# EAGLE design MinimalDuino (EAGLE 7.7.0)
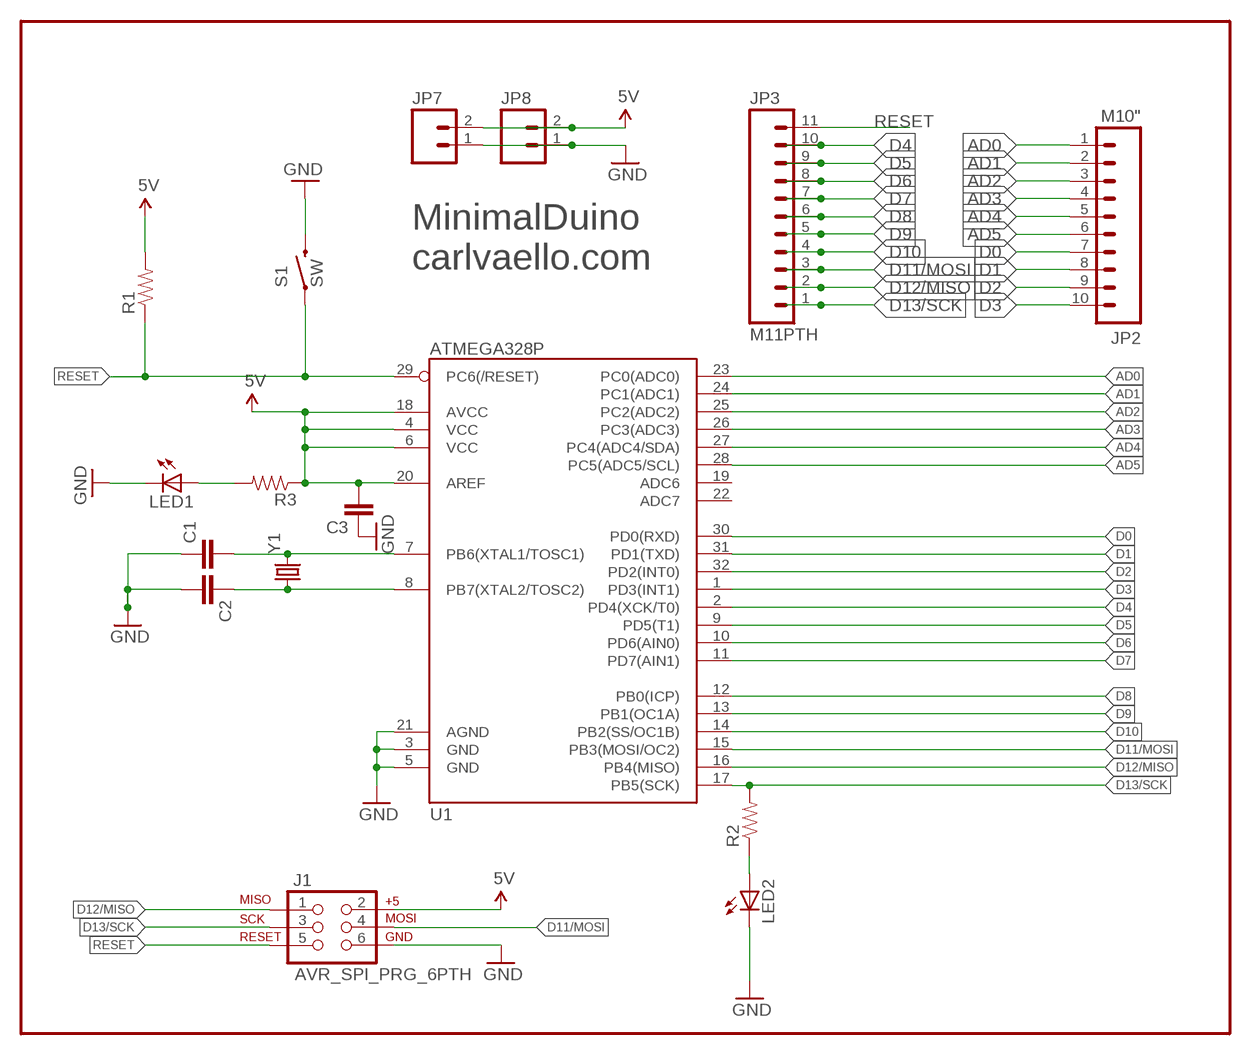
[diagram p0: schematic, sheet 1]

## Parts
C1  CAP0805  [0805]
C2  CAP0805  [0805]
C3  CAP0805  [0805]
J1  AVR_SPI_PRG_6PTH  [2X3]
JP2  M10"  [1X10]
JP3  M11PTH  [1X11]
JP7  M02PTH  [1X02]
JP8  M02PTH  [1X02]
LED1  LEDSML0805  [SML0805]
LED2  LEDSML0805  [SML0805]
R1  RESISTOR0805-RES  [0805]
R2  RESISTOR0805-RES  [0805]
R3  RESISTOR0805-RES  [0805]
S1  SW  SWITCH-MOMENTARY-2SIDE_EZ  [TACTILE-PTH-SIDEEZ]
U1  ATMEGA328P  ATMEGA328_SMT  [TQFP32-08]
Y1  CRYSTALHC49US  [HC49US]

## Nets
5V: C3.2 J1.2 JP7.2 JP8.2 R1.2 R3.1 U1.4(VCC) U1.6(VCC) U1.18(AVCC) U1.20(AREF)
AD0: JP2.1 U1.23(PC0(ADC0))
AD1: JP2.2 U1.24(PC1(ADC1))
AD2: JP2.3 U1.25(PC2(ADC2))
AD3: JP2.4 U1.26(PC3(ADC3))
AD4: JP2.5 U1.27(PC4(ADC4/SDA))
AD5: JP2.6 U1.28(PC5(ADC5/SCL))
D0: JP2.7 U1.30(PD0(RXD))
D1: JP2.8 U1.31(PD1(TXD))
D2: JP2.9 U1.32(PD2(INT0))
D3: JP2.10 U1.1(PD3(INT1))
D4: JP3.10 U1.2(PD4(XCK/T0))
D5: JP3.9 U1.9(PD5(T1))
D6: JP3.8 U1.10(PD6(AIN0))
D7: JP3.7 U1.11(PD7(AIN1))
D8: JP3.6 U1.12(PB0(ICP))
D9: JP3.5 U1.13(PB1(OC1A))
D10: JP3.4 U1.14(PB2(SS/OC1B))
D11/MOSI: J1.4 JP3.3 U1.15(PB3(MOSI/OC2))
D12/MISO: J1.1 JP3.2 U1.16(PB4(MISO))
D13/SCK: J1.3 JP3.1 R2.2 U1.17(PB5(SCK))
GND: C1.1 C2.2 C3.1 J1.6 JP7.1 JP8.1 LED1.C LED2.C S1.2 U1.3(GND) U1.5(GND) U1.21(AGND)
N$1: C1.2 U1.7(PB6(XTAL1/TOSC1)) Y1.2
N$2: C2.1 U1.8(PB7(XTAL2/TOSC2)) Y1.1
N$3: LED1.A R3.2
N$4: LED2.A R2.1
RESET: J1.5 JP3.11 R1.1 S1.1 U1.29(PC6(/RESET))
Unconnected: U1.19(ADC6) U1.22(ADC7)

## Notes on the sheet
- MinimalDuino
  carlvaello.com

## Library data of the parts
C1-C3 = SparkFun-Passives:CAP: Capacitor Standard 0603 ceramic capacitor, and 0.1" leaded capacitor.
J1 = SparkFun-Connectors:AVR_SPI_PRG_6: AVR ISP 6 Pin This is the reduced ISP connector for AVR programming. Common on Arduino. This footprint will take up less PCB space and can be used with a 10-pin to 6-pin adapter such as SKU: BOB-08508
JP2 = SparkFun-Connectors:M10: Header 10 Standard 10-pin 0.1" header. Use with straight break away headers (SKU : PRT-00116), right angle break away headers (PRT-00553), swiss pins (PRT-00743), machine pins (PRT-00117), and female headers (PRT-00115).
JP3 = SparkFun-Connectors:M11: Header 11 Standard 11-pin 0.1" header. Use with straight break away headers (SKU : PRT-00116), right angle break away headers (PRT-00553), swiss pins (PRT-00743), machine pins (PRT-00117), and female headers (PRT-00115).
JP7 JP8 = SparkFun-Connectors:M02: Header 2 Standard 2-pin 0.1" header. Use with straight break away headers (SKU : PRT-00116), right angle break away headers (PRT-00553), swiss pins (PRT-00743), machine pins (PRT-00117), and female headers (PRT-00115). Molex polarized connector foot print use with SKU : PRT-08233 with associated crimp pins and housings.
LED1 LED2 = led:LED: LED OSRAM: - CHIPLED LG R971, LG N971, LY N971, LG Q971, LY Q971, LO R971, LY R971 LH N974, LH R974 LS Q976, LO Q976, LY Q976 LO Q996 - Hyper CHIPLED LW Q18S LB Q993, LB Q99A, LB R99A - SideLED LS A670, LO A670, LY A670, LG A670, LP A670 LB A673, LV A673, LT A673, LW A673 LH A674 LY A675 LS A676, LA A676, LO A676, LY A676, LW A676 LS A679, LY A679, LG A679 - Hyper Micro SIDELED® LS Y876, LA Y876, LO Y876, LY Y876 LT Y87S - SmartLED LW L88C, LW L88S LB L89C, LB L89S, LG L890 LS L89K, LO L89K, LY L89K LS L896, LA L896, LO L896, LY L896 - TOPLED LS T670, LO T670, LY T670, LG T670, LP T670 LSG T670, LSP T670, LSY T670, LOP T670, LYG T670 LG T671, LOG T671, LSG T671 LB T673, LV T673, LT T673, LW T673 LH T674 LS T676, LA T676, LO T676, LY T676, LB T676, LH T676, LSB T676, LW T676 LB T67C, LV T67C, LT T67C, LS T67K, LO T67K, LY T67K, LW E67C LS E67B, LA E67B, LO E67B, LY E67B, LB E67C, LV E67C, LT E67C LW T67C LS T679, LY T679, LG T679 LS T770, LO T770, LY T770, LG T770, LP T770 LB T773, LV T773, LT T773, LW T773 LH T774 LS E675, LA E675, LY E675, LS T675 LS T776, LA T776, LO T776, LY T776, LB T776 LHGB T686 LT T68C, LB T68C - Hyper Mini TOPLED® LB M676 - Mini TOPLED Santana® LG M470 LS M47K, LO M47K, LY M47K Source: http://www.osram.convergy.de LUXEON: - LUMILED® LXK2-PW12-R00, LXK2-PW12-S00, LXK2-PW14-U00, LXK2-PW14-V00 LXK2-PM12-R00, LXK2-PM12-S00, LXK2-PM14-U00 LXK2-PE12-Q00, LXK2-PE12-R00, LXK2-PE12-S00, LXK2-PE14-T00, LXK2-PE14-U00 LXK2-PB12-K00, LXK2-PB12-L00, LXK2-PB12-M00, LXK2-PB14-N00, LXK2-PB14-P00, LXK2-PB14-Q00 LXK2-PR12-L00, LXK2-PR12-M00, LXK2-PR14-Q00, LXK2-PR14-R00 LXK2-PD12-Q00, LXK2-PD12-R00, LXK2-PD12-S00 LXK2-PH12-R00, LXK2-PH12-S00 LXK2-PL12-P00, LXK2-PL12-Q00, LXK2-PL12-R00 Source: www.luxeon.com KINGBRIGHT: KA-3528ASYC Source: www.kingbright.com
R1-R3 = SparkFun-Passives:RESISTOR: Resistor Basic schematic elements and footprints for 0603, 1206, and PTH resistors.
S1 = SparkFun-Electromechanical:SWITCH-MOMENTARY-2: Various NO switches- pushbuttons, reed, etc
U1 = SparkFun-DigitalIC:ATMEGA328_SMT: 32-Pin Atmega328 part Commonly used on Arduino compatible boards Available in QFP and QFN packages TQFP is IC-09069 QFN is non-stock; PROD_ID: IC-09069
Y1 = SparkFun-FreqCtrl:CRYSTAL: Various standard crystals. Proven footprints. Spark Fun Electronics SKU : COM-00534

## Board
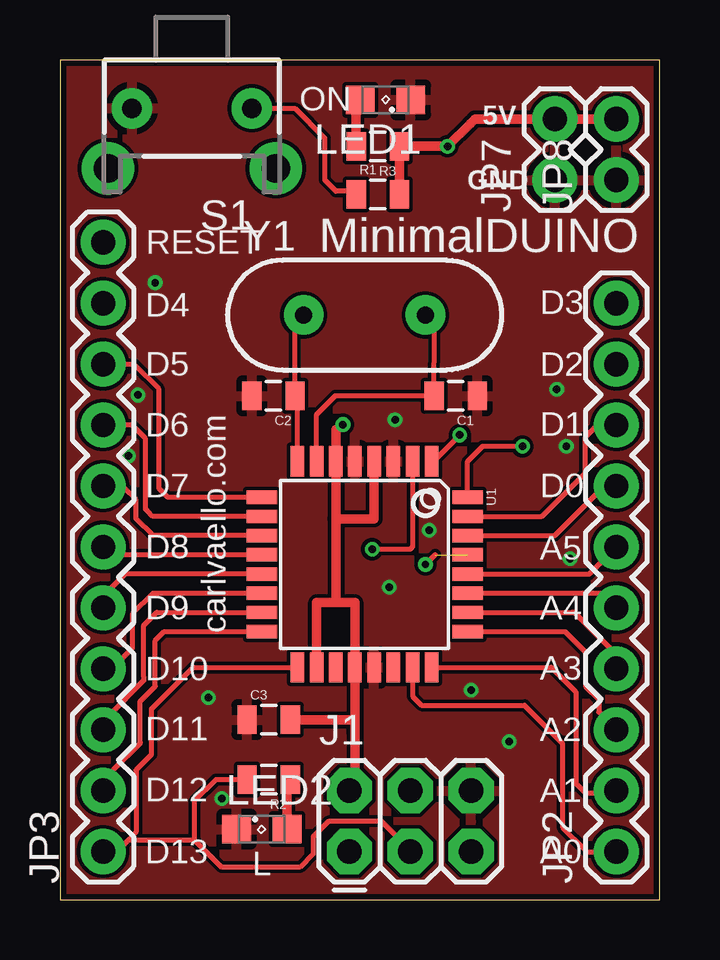
[diagram p1: board, top side]
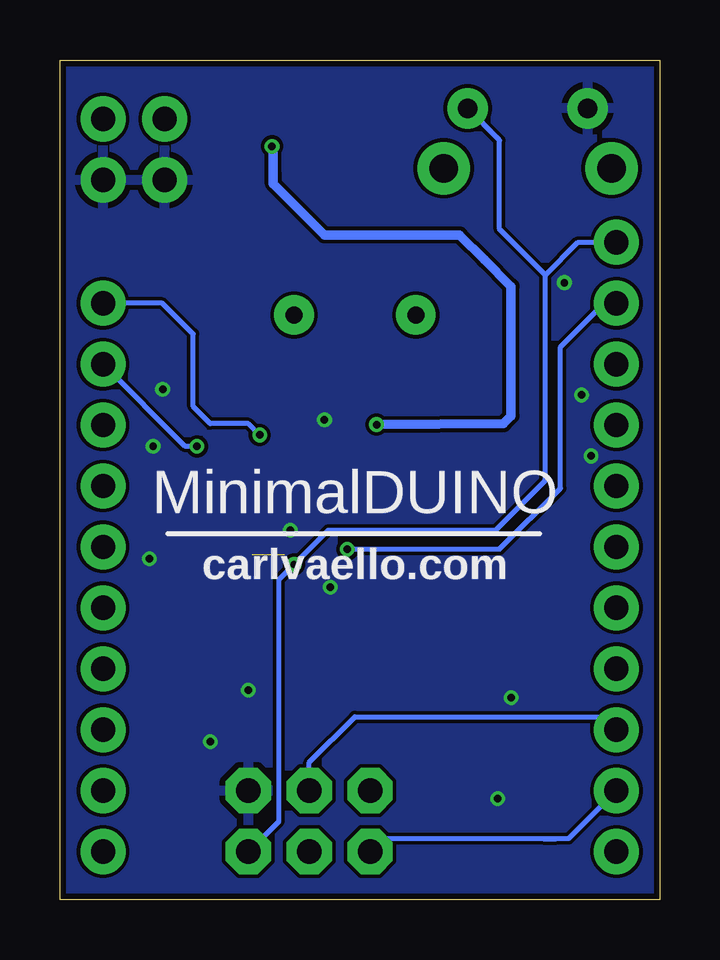
[diagram p2: board, bottom side, seen from below]

Size 25 x 35 mm. Coordinates in mm from the lower left corner, seen from the top.
Outline: 0,0 25,0 25,35 0,35 0,0
Copper layers (1*2*15*16): Top 0.035mm / dielectric 0.2mm / layer 2 0.0175mm / dielectric 1.1mm / layer 15 0.0175mm / dielectric 0.2mm / Bottom 0.035mm
Design rules "SeeedStudio_DRU_no_angle_20130527": minimum track width 6mil, minimum drill 12mil, track to track 6mil, track to pad 6mil, pad to pad 6mil, via to via 6mil, smd to smd 0mil, copper to edge 10mil, drill to drill 10mil, minimum pad ring 6mil, minimum via ring 6mil, stop-mask expansion 2mil, vias tented up to drill 25mil, thermal gap 10mil

### Footprints (pad centres in the part's own frame; a part is rotated, then mirrored left to right if it is on the bottom)
0805 = smd 0.8 x 1.2: 1 -0.9,0; 2 0.9,0
2X3 = drill 1.016 pad 1.88 octagon: 1 0,0; 2 0,2.54; 3 2.54,0; 4 2.54,2.54; 5 5.08,0; 6 5.08,2.54
1X10 = drill 1.016 pad 1.88: 1 0,0; 2 2.54,0; 3 5.08,0; 4 7.62,0; 5 10.16,0; 6 12.7,0; 7 15.24,0; 8 17.78,0; 9 20.32,0; 10 22.86,0
1X11 = drill 1.016 pad 1.88: 1 0,0; 2 2.54,0; 3 5.08,0; 4 7.62,0; 5 10.16,0; 6 12.7,0; 7 15.24,0; 8 17.78,0; 9 20.32,0; 10 22.86,0; 11 25.4,0
1X02 = drill 1.016 pad 1.88: 1 0,0; 2 2.54,0
SML0805 = smd 1.2 x 1.2: A 1.05,0; C -1.05,0
TACTILE-PTH-SIDEEZ = drill 0.8 pad 1.7: 1 -2.5,0; 2 2.5,0 | drill 1.2 pad 2.2: ANCHOR1 -3.5,2.5; ANCHOR2 3.5,2.5
TQFP32-08 = smd 1.27 x 0.559: 1 -4.293,2.8; 2 -4.293,2; 3 -4.293,1.2; 4 -4.293,0.4; 5 -4.293,-0.4; 6 -4.293,-1.2; 7 -4.293,-2; 8 -4.293,-2.8; 17 4.293,-2.8; 18 4.293,-2; 19 4.293,-1.2; 20 4.293,-0.4; 21 4.293,0.4; 22 4.293,1.2; 23 4.293,2; 24 4.293,2.8 | smd 0.559 x 1.27: 9 -2.8,-4.293; 10 -2,-4.293; 11 -1.2,-4.293; 12 -0.4,-4.293; 13 0.4,-4.293; 14 1.2,-4.293; 15 2,-4.293; 16 2.8,-4.293; 25 2.8,4.293; 26 2,4.293; 27 1.2,4.293; 28 0.4,4.293; 29 -0.4,4.293; 30 -1.2,4.293; 31 -2,4.293; 32 -2.8,4.293
HC49US = drill 0.7 pad 1.651: 1 -2.54,0; 2 2.54,0

### Placement (x,y rotation side)
C1  16.5,21 180 top
C2  8.9,21 180 top
C3  8.7,7.5 0 top
J1  12.06,2 0 top
JP2  23.2,2 90 top
JP3  1.8,2 90 top
JP7  20.64,30 90 top
JP8  23.2,30 90 top
LED1  13.57,33.34 180 top
LED2  8.41,2.94 0 top
R1  13.25,29.4 0 top
R2  8.7,5 180 top
R3  13.25,31.4 180 top
S1  5.5,32.98 180 top
U1  12.7,13.97 270 top
Y1  12.7,24.37 0 top

### Tracks (layer width: path | path; a pad name or v marks a point on that pad's centre or on a via)
5V  (via drill 0.31)
  Top 0.2: 11.5,15.88 U1.6 | 11.5,12.45 11.43,12.38
  Top 0.4: U1.4 13.1,15.88 12.06,15.88 11.5,15.88 | U1.18 10.7,12.38 11.43,12.38 11.75,12.38 12.3,12.38 U1.20 12.3,7.78 12.3,7.3 12.3,6.99 | 12.3,6.99 12.3,5.08 12.3,4.78 J1.2 | 11.5,12.45 U1.6 11.5,19.6 v11.8,19.8 | JP8.2 JP7.2 17.3,32.54 17.11,32.34 | R1.2 R3.1 15.05,31.4 v16.16,31.4 | v16.16,31.4 17.11,32.34 | v16.16,31.4 17.11,32.34 | C3.2 12.1,7.5 12.3,7.5 12.3,6.99
  Bottom 0.4: v11.8,19.8 6.51,19.84 6.19,20.16 6.19,25.56 7.3,26.67 8.33,27.7 13.34,27.7 13.97,27.7 16.11,29.84 16.11,30.24 | 16.11,29.92 16.11,30.24 | 16.11,30.24 16.11,31.35 v16.16,31.4
AD0
  Top 0.2: U1.23 14.7,8.48 15.08,8.1 19.37,8.1 20.95,6.51 20.95,4.75 20.95,3.02 21.91,2.06 21.97,2 JP2.1
AD1
  Top 0.2: U1.24 20.48,9.68 21.11,9.05 21.51,8.65 21.51,4.84 21.91,4.45 23.11,4.45 JP2.2
AD2
  Top 0.2: U1.25 20.26,11.17 21.06,11.17 21.91,10.32 21.91,8.89 22.46,8.33 22.46,7.82 JP2.3
AD3
  Top 0.2: U1.26 21.35,11.97 21.45,11.97 22.46,10.95 23.2,10.22 JP2.4
AD4
  Top 0.2: U1.27 17,12.78 21.99,12.78 22.58,12.78 JP2.5
AD5
  Top 0.2: U1.28 21.57,13.57 22.07,13.57 JP2.6
D0
  Top 0.2: JP2.7 22.7,17.24 22.23,16.77 20.63,15.17 U1.30
D1
  Top 0.2: U1.31 20.1,15.97 21.91,17.78 21.91,19.29 22.3,19.68 22.4,19.78 JP2.8
D2  (via drill 0.31)
  Top 0.2: U1.32 16.99,18.26 17.62,18.89 v19.29,18.89
  Bottom 0.2: v19.29,18.89 19.27,18.89 v19.29,18.89 | v19.29,18.89 19.77,18.89 JP2.9
D3  (via drill 0.31)
  Top 0.2: U1.1 15.56,18.26 v16.67,19.37
  Bottom 0.2: v16.67,19.37 17.14,19.84 18.73,19.84 19.45,20.56 19.45,23.57 20.73,24.86 JP2.10
D4  (via drill 0.31)
  Top 0.2: U1.2 14.7,14.7 14.61,14.61 v13.02,14.61
  Bottom 0.2: v13.02,14.61 6.67,14.61 4.13,17.14 4.13,23.03 2.3,24.86 JP3.10
D5
  Top 0.2: U1.9 4.5,16.77 4.13,17.14 4.13,21.27 3.1,22.3 1.82,22.3 JP3.9
D6
  Top 0.2: U1.10 3.87,15.97 3.65,16.19 3.57,16.27 3.57,19.21 3,19.78 JP3.8
D7
  Top 0.2: U1.11 3.88,15.17 3.17,15.88 3.17,16.67 2.7,17.14 2.6,17.24 JP3.7
D8
  Top 0.2: U1.12 2.63,14.37 2.13,14.37 JP3.6
D9
  Top 0.2: U1.13 2.71,13.57 1.8,12.66 JP3.5
D10
  Top 0.2: U1.14 3.88,12.77 3.02,11.91 3.02,10.48 2.7,10.16 2.66,10.12 2.16,9.62 JP3.4
D11/MOSI
  Top 0.2: U1.15 4.03,11.97 3.49,11.43 3.49,9.27 3.49,9.13 1.98,7.62 1.98,7.26 JP3.3
  Bottom 0.2: J1.4 14.61,5.71 12.7,7.62 2.32,7.62 1.84,7.12 JP3.3
D12/MISO
  Top 0.2: U1.16 4.34,11.17 3.97,10.79 3.97,8.89 3.33,8.26 3.33,6.57 3.33,6.51 2.22,5.4 1.8,4.97 JP3.2
  Bottom 0.2: 4.84,2.54 4.3,2.54 | JP3.2 3.8,2.54 4.84,2.54 | 4.84,2.54 11.53,2.54 J1.1
D13/SCK
  Top 0.2: 14.61,1.91 J1.3 14.61,2.06 13.41,3.25 11.19,3.25 10.56,2.62 10.56,1.91 10,1.35 6.75,1.35 5.6,2.5 | U1.17 5.56,9.68 3.81,7.94 3.81,6.03 3.17,5.4 3.17,2.82 2.86,2.5 | 2.86,2.5 5.6,2.5 | 2.86,2.5 2.36,2 JP3.1 | R2.2 6.51,5 5.6,4.09 5.6,2.5
GND  (via drill 0.31)
  other vias: 13.97,20 6.75,4.21 17.14,8.73 18.73,6.59 15.4,15.4 3.25,21.03 21.11,18.89 6.19,8.41 13.73,13.02 2.86,18.49 21.27,14.21 3.97,25.72 20.72,21.27
  pour Bottom: 0,35 25,35 25,0 0,0
  pour Top: 0,35 25,35 25,0 0,0
N$1
  Top 0.2: U1.7 10.7,20.23 11.43,20.95 11.47,21 C1.2 15.61,23.76 Y1.2
N$2
  Top 0.2: U1.8 9.9,20.84 C2.1 9.8,24.09 Y1.1 9.79,24.08
N$3
  Top 0.4: R3.2 12.35,33.16 LED1.A
N$4
  Top 0.2: 9.64,4.93 R2.1
  Top 0.4: LED2.A 9.46,4.86 R2.1
RESET  (via drill 0.31)  (1 unrouted)
  Top 0.2: 15.64,14.37 v15.24,13.97 | S1.1 9.32,32.98 9.8,32.98 11.03,31.75 11.03,30 11.51,29.53 12.22,29.53 R1.1
  Bottom 0.2: 4.76,26.04 4.76,17.46 6.83,15.4 13.81,15.4 v15.24,13.97 15.88,13.34 15.88,3.27 J1.5 | 4.76,26.04 6.67,27.94 6.67,31.65 S1.1 | 4.76,26.04 3.4,27.4 JP3.11

### Text on the board
_tsilk: ON | 5V | GND | RESET | MinimalDUINO | D4 | D3 | D5 | D2 | D6 | D1 | D7 | D0 | D8 | A5 | D9 | A4 | carlvaello.com | D10 | A3 | D11 | A2 | D12 | A1 | D13 | L | A0
_bsilk: MinimalDUINO | carlvaello.com